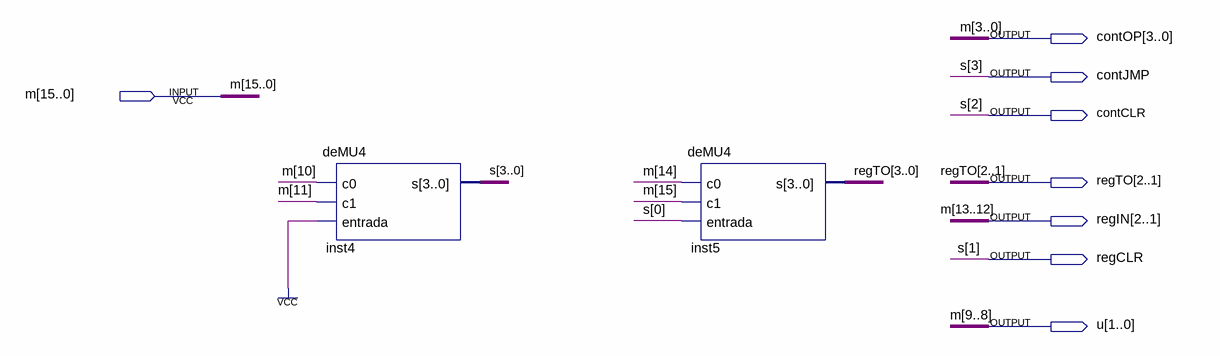
[diagram p0: schematic sheet]
// Quartus schematic controle.bdf as structural Verilog: 2 symbols, 8 pins
module controle (
  input  [15:0] m,
  output [3:0] contOP,
  output contJMP,
  output contCLR,
  output [3:0] regTO,
  output [2:1] regIN,
  output regCLR,
  output [1:0] u
);

  wire [0:0] s;

  deMU4 inst4 (.c0(m[10]), .c1(m[11]), .entrada(1'b1), .s({contJMP, contCLR, regCLR, s[0]}));
  deMU4 inst5 (.c0(m[14]), .c1(m[15]), .entrada(s[0]), .s(regTO));

  assign contOP = m[3:0];
  assign regIN = m[13:12];
  assign u = m[9:8];

  // Other names for the same wires on the sheet: s[3:1] = {contJMP, contCLR, regCLR}
endmodule
